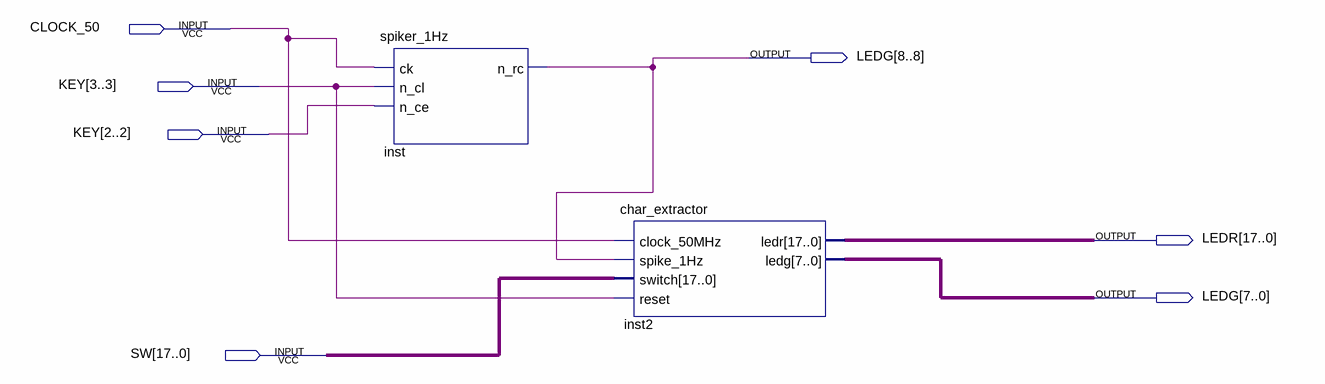
[diagram p0: schematic sheet]
// Quartus schematic lampeggiatore_asimmetrico.bdf as structural Verilog: 2 symbols, 7 pins
module lampeggiatore_asimmetrico (
  input  CLOCK_50,
  input  [3:2] KEY,
  input  [17:0] SW,
  output [8:0] LEDG,
  output [17:0] LEDR
);

  spiker_1Hz inst (.ck(CLOCK_50), .n_cl(KEY[3]), .n_ce(KEY[2]), .n_rc(LEDG[8]));
  char_extractor inst2 (
    .clock_50MHz(CLOCK_50), .spike_1Hz(LEDG[8]), .switch(SW), .reset(KEY[3]), .ledr(LEDR), .ledg(LEDG[7:0]));
endmodule
